# EAGLE design solar_collector_controller_V1.21 (EAGLE 6.5.0)
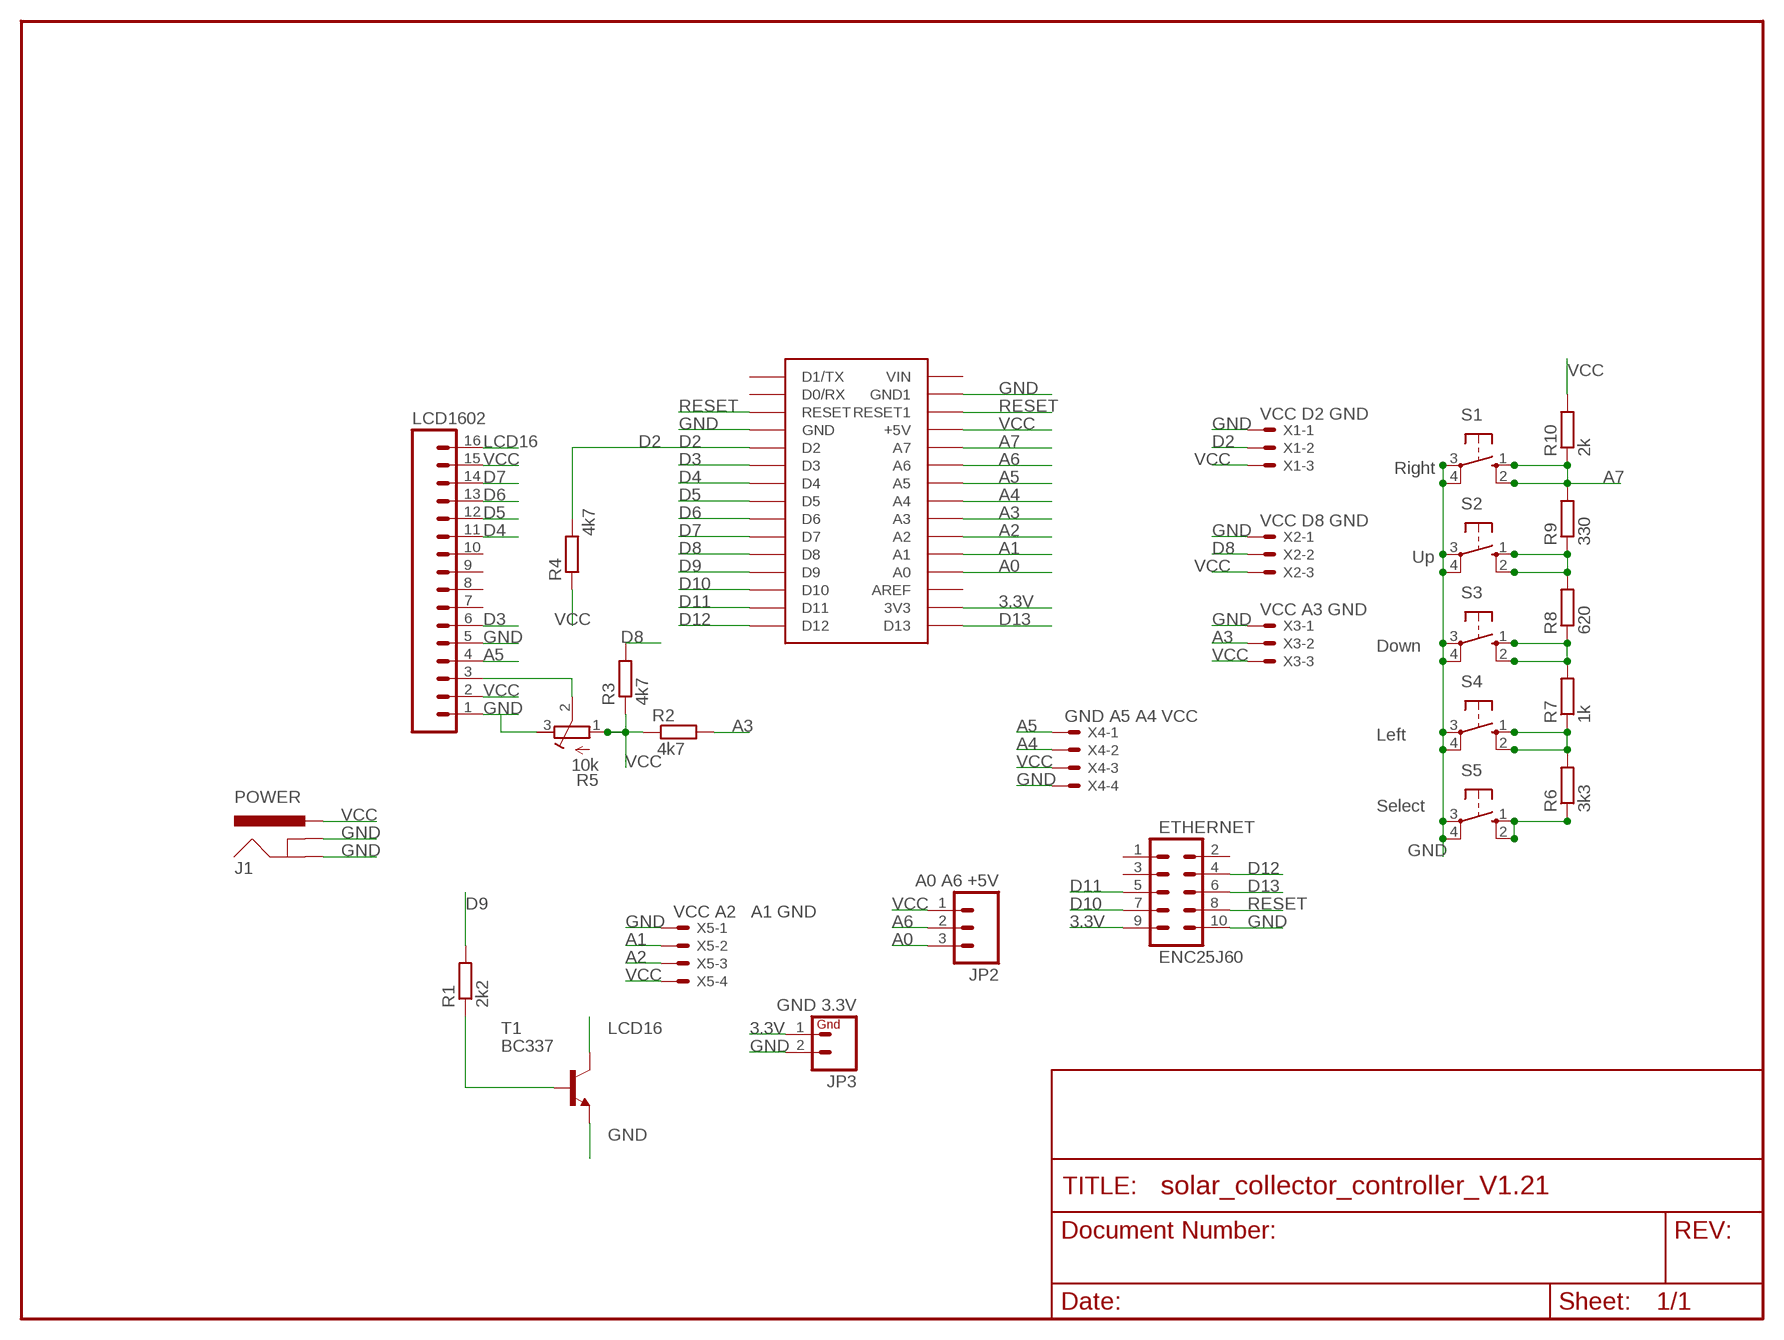
[diagram p0: schematic, sheet 1]

## Parts
ETHERNET  ENC25J60  M05X2PTH  [AVR_ICSP]
J1  POWER  POWER_JACKPTH_LOCK  [POWER_JACK_PTH_LOCK]
JP2  A0 A6 +5V  M03PTH  [1X03]
JP3  GND 3.3V  M02PTH  [1X02]
LCD1602  HEADER-16P-2.54  [16P-2.54]
R1  2k2  R-EU_0207/10  [0207/10]
R2  4k7  R-EU_0207/10  [0207/10]
R3  4k7  R-EU_0207/10  [0207/10]
R4  4k7  R-EU_0207/10  [0207/10]
R5  10k  R-TRIMM64W  [RTRIM64W]
R6  3k3  R-EU_0207/10  [0207/10]
R7  1k  R-EU_0207/10  [0207/10]
R8  620  R-EU_0207/10  [0207/10]
R9  330  R-EU_0207/10  [0207/10]
R10  2k  R-EU_0207/10  [0207/10]
S1  Right  10-XX  [B3F-10XX]
S2  Up  10-XX  [B3F-10XX]
S3  Down  10-XX  [B3F-10XX]
S4  Left  10-XX  [B3F-10XX]
S5  Select  10-XX  [B3F-10XX]
T1  BC337  [TO92]
U$2  ARDUINONANO  [PDIP-32]
X1  VCC D2 GND  22-23-2031  [22-23-2031]
X2  VCC D8 GND  22-23-2031  [22-23-2031]
X3  VCC A3 GND  22-23-2031  [22-23-2031]
X4  GND A5 A4 VCC  22-23-2041  [22-23-2041]
X5  VCC A2 A1 GND  22-23-2041  [22-23-2041]

## Nets
3.3V: ETHERNET.9 JP3.1 U$2.3V3
A0: JP2.3 U$2.A0
A1: U$2.A1 X5.2
A2: U$2.A2 X5.3
A3: R2.2 U$2.A3 X3.2
A4: U$2.A4 X4.2
A5: LCD1602.4 U$2.A5 X4.1
A6: JP2.2 U$2.A6
A7: R9.2 R10.1 S1.1(S) S1.2(S1) U$2.A7
D2: R4.2 U$2.D2 X1.2
D3: LCD1602.6 U$2.D3
D4: LCD1602.11 U$2.D4
D5: LCD1602.12 U$2.D5
D6: LCD1602.13 U$2.D6
D7: LCD1602.14 U$2.D7
D8: R3.2 U$2.D8 X2.2
D9: R1.2 U$2.D9
D10: ETHERNET.7 U$2.D10
D11: ETHERNET.5 U$2.D11
D12: ETHERNET.4 U$2.D12
D13: ETHERNET.6 U$2.D13
GND [vcc]: ETHERNET.10 J1.GND J1.GNDBREAK JP3.2 LCD1602.1 LCD1602.5 R5.3(A) S1.3(P) S1.4(P1) S2.3(P) S2.4(P1) S3.3(P) S3.4(P1) S4.3(P) S4.4(P1) S5.3(P) S5.4(P1) T1.1(E) U$2.GND U$2.GND1 X1.1 X2.1 X3.1 X4.4 X5.1
LCD16: LCD1602.16 T1.3(C)
N$1: LCD1602.3 R5.2(S)
N$4: R1.1 T1.2(B)
N$5: R6.1 S5.1(S) S5.2(S1)
N$6: R6.2 R7.1 S4.1(S) S4.2(S1)
N$8: R7.2 R8.1 S3.1(S) S3.2(S1)
N$11: R8.2 R9.1 S2.1(S) S2.2(S1)
RESET: ETHERNET.8 U$2.RESET U$2.RESET1
VCC: J1.PWR JP2.1 LCD1602.2 LCD1602.15 R2.1 R3.1 R4.1 R5.1(E) R10.2 U$2.+5V X1.3 X2.3 X3.3 X4.3 X5.4
Unconnected: ETHERNET.1 ETHERNET.2 ETHERNET.3 LCD1602.7 LCD1602.8 LCD1602.9 LCD1602.10 U$2.AREF U$2.D0/RX U$2.D1/TX U$2.VIN

## Library data of the parts
ETHERNET = SparkFun-Connectors:M05X2: Header 5x2 Standard 10-pin dual row 0.1" header. Commonly used with AVR-ISP. Use with Spark Fun Electronics SKU: PRT-00778
J1 = SparkFun-Connectors:POWER_JACK: Power Jack This is the standard 5.5mm barrel jack for power. The PTH is the most common, proven, reliable, footprint. The Slot footprint only works if the mill layer is transmitted to the PCB fab house so be warned. Spark Fun Electronics SKU : PRT-00119 SMT: CONN-08106 Mating wall wart : TOL-00298 (and others)
JP2 = SparkFun-Connectors:M03: Header 3 Standard 3-pin 0.1" header. Use with straight break away headers (SKU : PRT-00116), right angle break away headers (PRT-00553), swiss pins (PRT-00743), machine pins (PRT-00117), and female headers (PRT-00115). Molex polarized connector foot print use with SKU : PRT-08232 with associated crimp pins and housings.
JP3 = SparkFun:M02: Header 2 Standard 2-pin 0.1" header. Use with straight break away headers (SKU : PRT-00116), right angle break away headers (PRT-00553), swiss pins (PRT-00743), machine pins (PRT-00117), and female headers (PRT-00115). Molex polarized connector foot print use with SKU : PRT-08233 with associated crimp pins and housings.
LCD1602 = Connector_seedstudio:HEADER-16P
R1-R4 R6-R10 = resistor:R-EU_: RESISTOR, European symbol
R5 = resistor:R-TRIMM: Trimm resistor
S1-S5 = switch-omron:10-XX: OMRON SWITCH; MPN: B3F-1000; OC_FARNELL: 176432; OC_NEWARK: 36M3542
T1 = transistor:BC337: NPN TRANSISTOR
U$2 = rocketfarm:ARDUINONANO
X1-X3 = con-molex:22-23-2031: .100" (2.54mm) Center Header - 3 Pin; MF: MOLEX; MPN: 22-23-2031; OC_FARNELL: 1462950; OC_NEWARK: 30C0862
X4 X5 = con-molex:22-23-2041: .100" (2.54mm) Center Header - 4 Pin; MF: MOLEX; MPN: 22-23-2041; OC_FARNELL: 1462920; OC_NEWARK: 38C0355

## Net classes
0 default: width 0.203 mm
1 vcc: width 0.254 mm

## Board
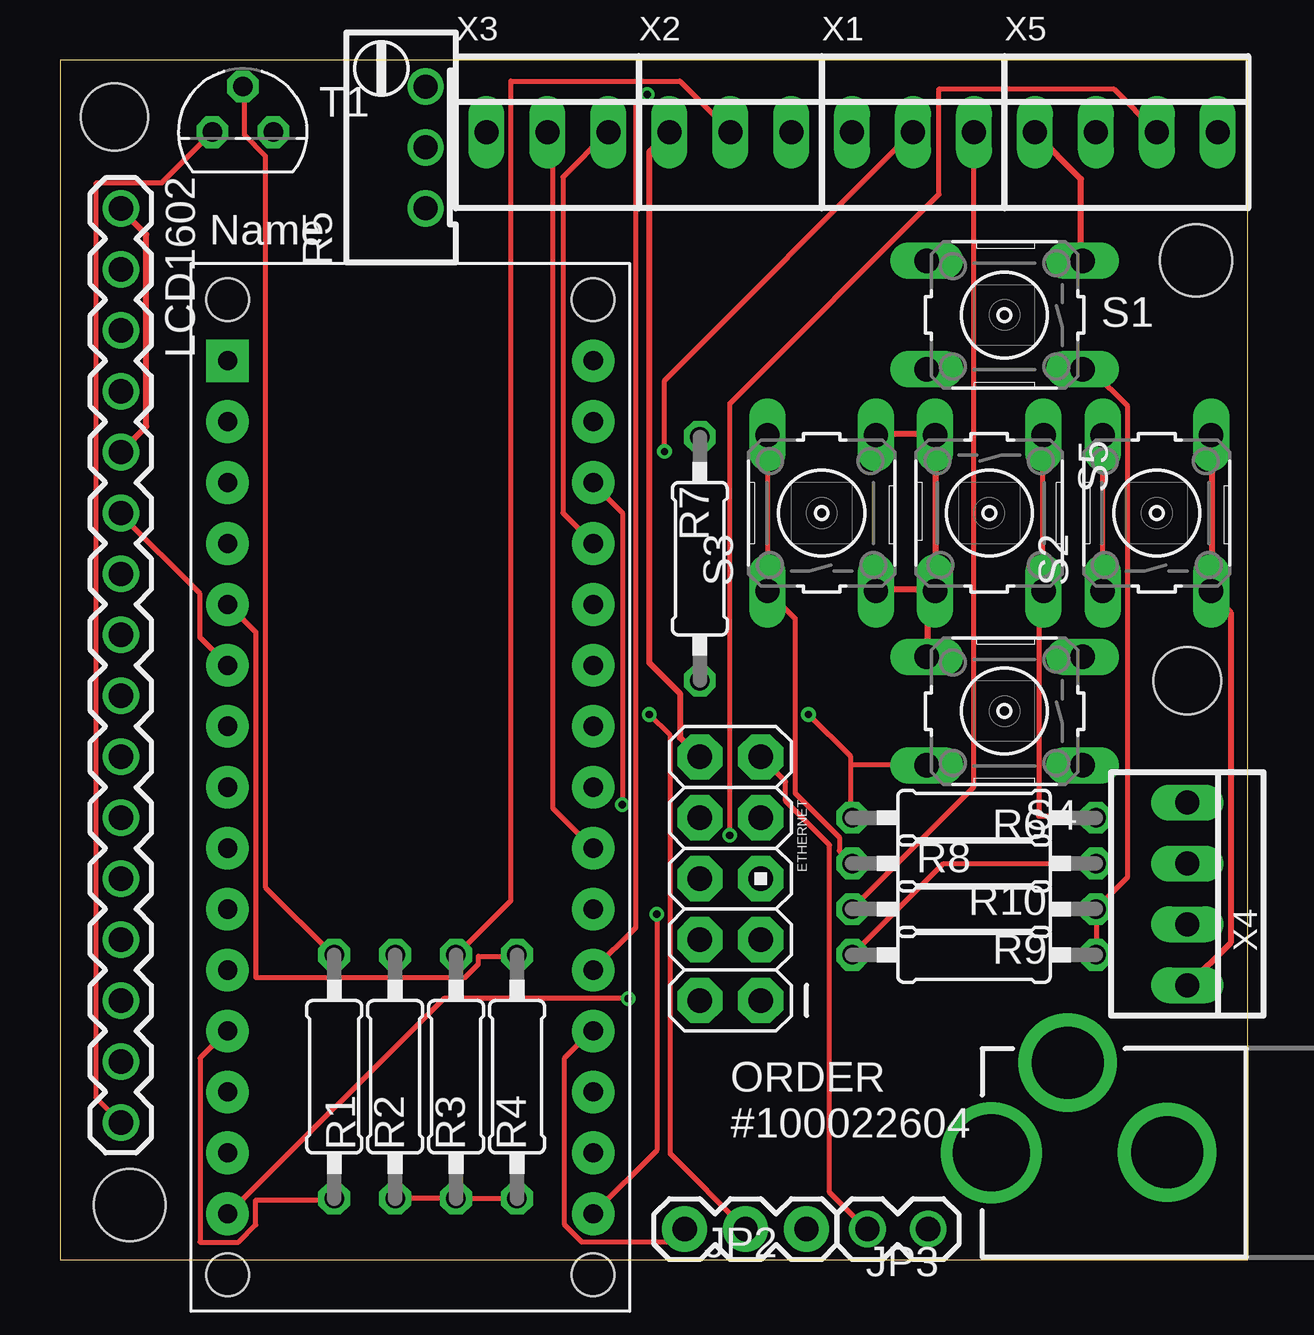
[diagram p1: board, top side]
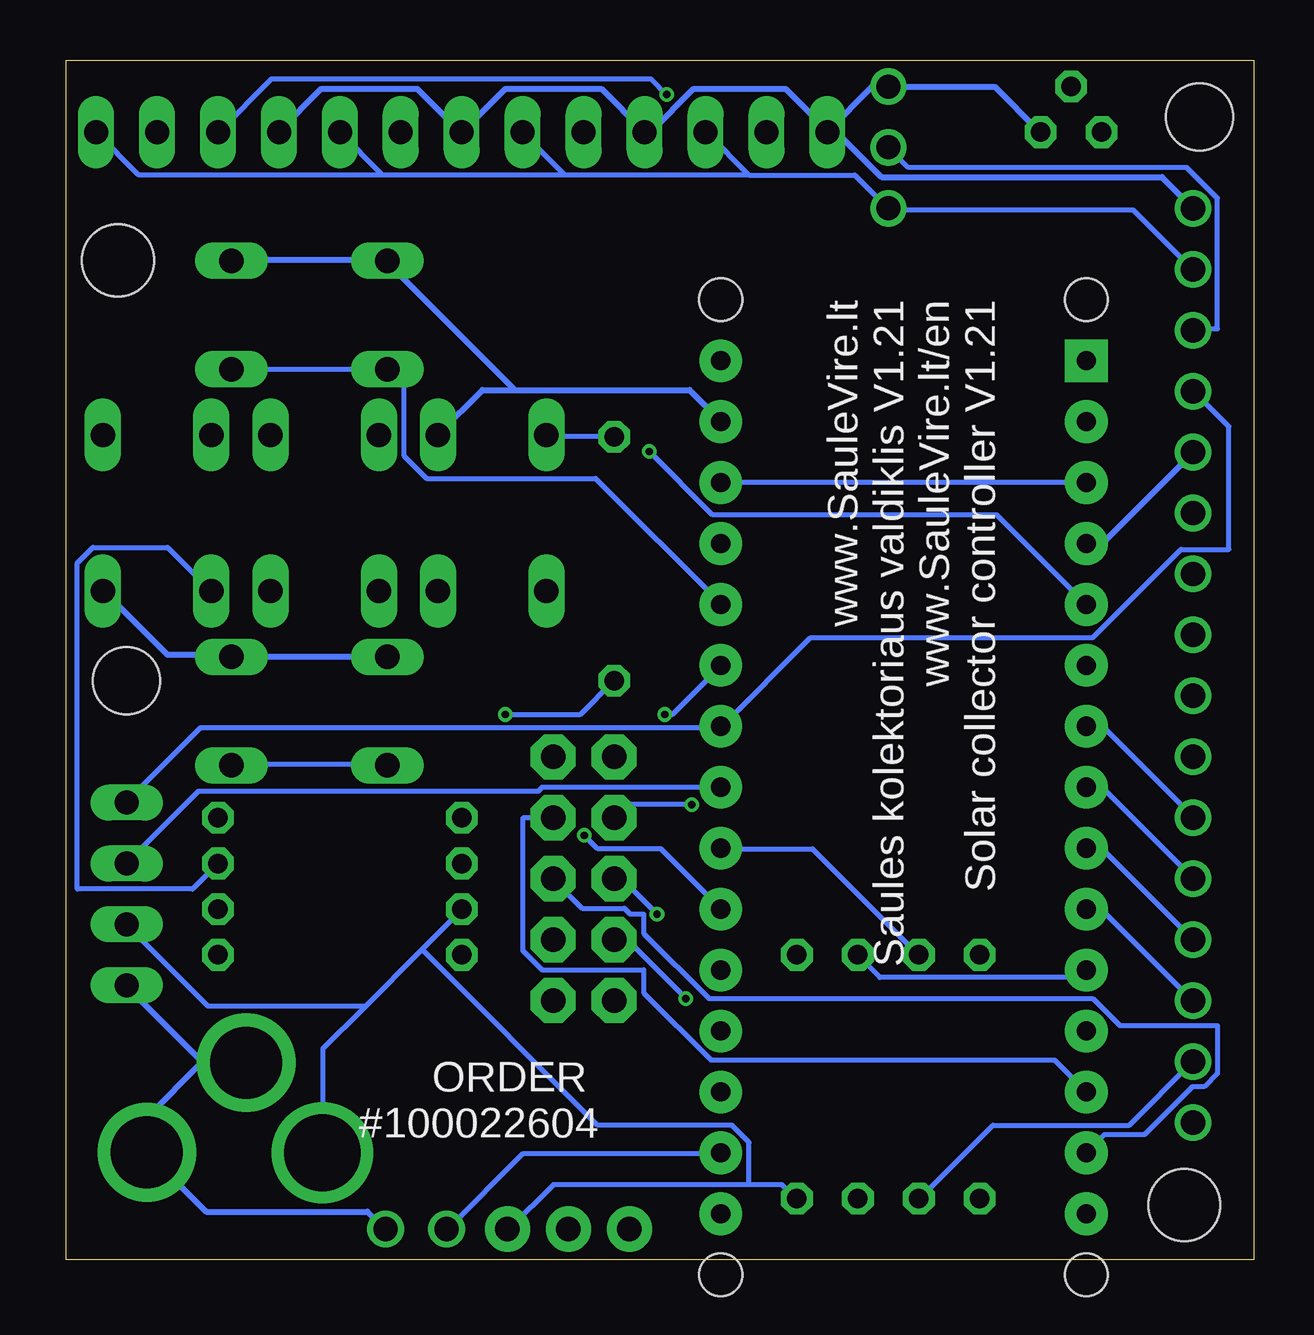
[diagram p2: board, bottom side, seen from below]

Size 49.51 x 50 mm. Coordinates in mm from the lower left corner, seen from the top.
Outline: 0,0 49.51,0 49.51,50 0,50 0,0
Copper layers (1*16): Top 0.035mm / dielectric 1.5mm / Bottom 0.035mm
Design rules "ITEADstudio_DRC": minimum track width 6mil, minimum drill 12mil, track to track 6mil, track to pad 6mil, pad to pad 6mil, via to via 6mil, smd to smd 0mil, copper to edge 10mil, drill to drill 10mil, minimum pad ring 10mil, minimum via ring 6mil, stop-mask expansion 2mil, vias tented up to drill 100mil, thermal gap 10mil
Holes 3 mm at 2.9,2.27 47.35,41.64
Holes 2.8 mm at 2.27,47.62 46.99,24.13

### Footprints (pad centres in the part's own frame; a part is rotated, then mirrored left to right if it is on the bottom)
AVR_ICSP = drill 1.016 pad 1.88 octagon: 1 -1.27,5.08; 2 1.27,5.08; 3 -1.27,2.54; 4 1.27,2.54; 5 -1.27,0; 6 1.27,0; 7 -1.27,-2.54; 8 1.27,-2.54; 9 -1.27,-5.08; 10 1.27,-5.08
POWER_JACK_PTH_LOCK = drill 2.997 pad 4.115: GND 0.025,6.557; GNDBREAK 3.762,10.7 | drill 3.2 pad 4.115: PWR 0,13.878
1X03 = drill 1.016 pad 1.88: 1 0,0; 2 2.54,0; 3 5.08,0
1X02 = drill 1.016: 1 0,0; 2 2.54,0
16P-2.54 = drill 1.016: 1 0,0; 2 2.54,0; 3 5.08,0; 4 7.62,0; 5 10.16,0; 6 12.7,0; 7 15.24,0; 8 17.78,0; 9 20.32,0; 10 22.86,0; 11 25.4,0; 12 27.94,0; 13 30.48,0; 14 33.02,0; 15 35.56,0; 16 38.1,0
0207/10 = drill 0.813 octagon: 1 -5.08,0; 2 5.08,0
RTRIM64W = drill 1: 1 1.27,-2.54; 2 1.27,0; 3 1.27,2.54
B3F-10XX = drill 1.016 long: 1 -3.251,2.261; 2 3.251,2.261; 3 -3.251,-2.261; 4 3.251,-2.261
TO92 = drill 0.813 octagon: 1 1.27,0; 2 0,1.905; 3 -1.27,0
PDIP-32 = drill 0.8 pad 1.778: 3V3 15.24,-35.56; +5V 15.24,-10.16; A0 15.24,-30.48; A1 15.24,-27.94; A2 15.24,-25.4; A3 15.24,-22.86; A4 15.24,-20.32; A5 15.24,-17.78; A6 15.24,-15.24; A7 15.24,-12.7; AREF 15.24,-33.02; D0/RX 0,-5.08; D2 0,-12.7; D3 0,-15.24; D4 0,-17.78; D5 0,-20.32; D6 0,-22.86; D7 0,-25.4; D8 0,-27.94; D9 0,-30.48; D10 0,-33.02; D11 0,-35.56; D12 0,-38.1; D13 15.24,-38.1; GND 0,-10.16; GND1 15.24,-5.08; RESET 0,-7.62; RESET1 15.24,-7.62; VIN 15.24,-2.54 | drill 0.8 pad 1.778 square: D1/TX 0,-2.54 | hole 1.778: 0,0; 0,-40.64; 15.24,-40.64; 15.24,0
22-23-2031 = drill 1 long: 1 -2.54,0; 2 0,0; 3 2.54,0
22-23-2041 = drill 1 long: 1 -3.81,0; 2 -1.27,0; 3 1.27,0; 4 3.81,0

### Placement (x,y rotation side)
ETHERNET  27.94,15.88 180 top
J1  52.7,4.45 90 top
JP2  31.11,1.27 180 top
JP3  33.66,1.27 0 top
LCD1602  2.54,43.81 270 top
R1  11.43,7.62 270 top
R2  13.97,7.62 90 top
R3  16.51,7.62 90 top
R4  19.05,7.62 90 top
R5  13.97,46.35 0 top
R6  38.1,18.41 180 top
R7  26.67,29.21 90 top
R8  38.1,16.51 0 top
R9  38.1,12.7 0 top
R10  38.1,14.61 180 top
S1  39.37,39.37 180 top
S2  45.72,31.11 90 top
S3  31.75,31.11 90 top
S4  39.37,22.86 180 top
S5  38.73,31.11 270 top
T1  7.62,46.99 0 top
U$2  6.99,40.01 0 top
X1  35.56,46.99 0 top
X2  27.94,46.99 0 top
X3  20.32,46.99 0 top
X4  46.99,15.24 270 top
X5  44.45,46.99 0 top

### Tracks (layer width: path | path; a pad name or v marks a point on that pad's centre or on a via)
3.3V
  Top 0.203: ETHERNET.9 29.28,20.88 30.24,19.92 30.24,19.12 32.08,17.28 32.08,2.8 33.6,1.28 JP3.1
  Bottom 0.203: JP3.1 33.6,1.28 30.48,4.4 22.24,4.4 U$2.3V3
A0
  Top 0.203: U$2.A0 22.16,9.52 21.04,8.4 21.04,1.44 21.76,0.72 26,0.72 26,1.2 JP2.3
A1  (via drill 0.3)
  Top 0.203: v24.48,48.56 24,48.08 24,13.84 U$2.A1
  Bottom 0.203: v24.48,48.56 25.12,49.2 40.96,49.2 43.12,47.04 X5.2
A2  (via drill 0.3)
  Top 0.203: v27.92,17.68 27.92,35.68 36.64,44.4 36.64,48.8 43.92,48.8 45.68,47.04 X5.3
  Bottom 0.203: v27.92,17.68 27.36,17.12 24.72,17.12 22.24,14.64 U$2.A2
A3
  Top 0.203: X3.2 20.32,46.96 20.56,46.72 20.56,18.8 22.16,17.2 U$2.A3
  Bottom 0.203: R2.2 14,12.72 18.4,17.12 22.16,17.12 U$2.A3
A4
  Bottom 0.203: X4.2 46.96,16.56 44,19.52 29.84,19.52 29.68,19.68 U$2.A4
A5
  Bottom 0.203: X4.1 46.96,19.12 43.92,22.16 22.24,22.16 U$2.A5 22.16,22.24 18.48,25.92 6.72,25.92 3.04,29.6 1.04,29.6 1.04,34.72 2.48,36.16 LCD1602.4
A6  (via drill 0.3)
  Top 0.203: v24.56,22.72 25.44,21.84 25.44,4.4 JP2.2
  Bottom 0.203: v24.56,22.72 24.24,22.72 22.24,24.72 U$2.A6
A7
  Top 0.203: R9.2 43.2,12.72 43.2,14.56 R10.1 43.2,14.64 44.48,15.92 44.48,35.6 43.04,37.04 42.64,37.04 S1.1
  Bottom 0.203: S1.1 42.56,37.12 36.16,37.12 S1.2 36.08,37.04 35.44,37.04 35.44,33.52 34.48,32.56 27.44,32.56 22.24,27.36 U$2.A7
D2  (via drill 0.3)
  Top 0.203: R4.2 19.04,12.64 17.44,12.64 17.44,12.32 16.88,11.76 8.16,11.76 8.16,26.16 7.04,27.28 U$2.D2 | v25.2,33.68 25.2,36.64 35.52,46.96 X1.2
  Bottom 0.203: v25.2,33.68 22.56,31.04 10.72,31.04 U$2.D2
D3
  Top 0.203: LCD1602.6 2.56,31.04 5.84,27.76 5.84,25.92 6.96,24.8 U$2.D3
D4
  Bottom 0.203: LCD1602.11 2.56,18.48 6.24,22.16 6.96,22.16 U$2.D4
D5
  Bottom 0.203: LCD1602.12 2.56,15.92 6.32,19.68 6.96,19.68 U$2.D5
D6
  Bottom 0.203: LCD1602.13 2.56,13.36 6.32,17.12 6.96,17.12 U$2.D6
D7
  Bottom 0.203: LCD1602.14 2.56,10.8 6.32,14.56 6.96,14.56 U$2.D7
D8
  Top 0.203: X2.2 27.92,47.04 25.84,49.12 18.8,49.12 18.8,14.96 16.56,12.72 R3.2
  Bottom 0.203: R3.2 16.48,12.64 15.6,11.76 7.28,11.76 7.04,12 U$2.D8
D9
  Top 0.203: R1.2 11.36,2.48 8.16,2.48 8.16,1.44 7.44,0.72 5.84,0.72 5.84,8.4 6.96,9.52 U$2.D9
D10
  Bottom 0.203: U$2.D10 8.32,8.32 22.64,8.32 25.44,11.12 25.44,12.08 29.68,12.08 30.48,12.88 30.48,18.4 29.28,18.4 ETHERNET.7
D11
  Bottom 0.203: U$2.D11 6.96,4.48 6.24,5.2 4.56,5.2 2.56,7.2 2.08,7.2 1.52,7.76 1.52,9.76 5.6,9.76 6.72,10.88 22.72,10.88 25.44,13.6 25.44,14.4 26,14.4 26.24,14.64 28,14.64 29.2,15.84 ETHERNET.5
D12  (via drill 0.3)
  Top 0.203: v23.68,10.88 16,10.88 7.04,1.92 U$2.D12
  Bottom 0.203: v23.68,10.88 26.08,13.28 26.64,13.28 ETHERNET.4
D13  (via drill 0.3)
  Top 0.203: U$2.D13 24.88,4.56 v24.88,14.4
  Bottom 0.203: v24.88,14.4 26.32,15.84 26.64,15.84 ETHERNET.6
GND
  Top 0.254: LCD1602.1 2.56,43.76 3.6,42.72 3.6,34.72 2.56,33.68 LCD1602.5 | ETHERNET.10 26.64,20.96 25.84,21.76 25.84,23.6 24.56,24.88 24.56,46.16 25.36,46.96 X2.1 | S2.4 48,34.32 48,27.92 S2.3 48,27.76 48.8,26.96 48.8,13.2 47.04,11.44 X4.4 | S3.3 34.08,27.92 36.4,27.92 S5.4 | S4.4 36.16,25.2 36.16,27.84 S5.4 | X5.1 40.64,46.96 42.56,45.04 42.56,41.68 S1.3 | S3.4 34.08,34.4 36.4,34.4 S5.3 36.48,34.24 36.48,28 S5.4
  Bottom 0.254: LCD1602.5 2.56,33.6 6.24,29.92 6.96,29.92 U$2.GND | T1.1 8.96,47.04 10.8,48.88 15.2,48.88 R5.3 15.36,48.88 15.92,48.88 17.76,47.04 X3.1 | X3.1 17.84,47.12 19.52,48.8 23.36,48.8 25.12,47.04 25.28,47.04 X2.1 25.44,47.04 27.2,48.8 31.2,48.8 32.96,47.04 X1.1 33.12,47.04 34.88,48.8 38.88,48.8 40.64,47.04 X5.1 | LCD1602.1 2.56,43.84 3.84,45.12 15.52,45.12 17.52,47.12 X3.1 | X4.4 46.96,11.36 43.84,8.24 42.08,8.24 J1.GNDBREAK 43.92,8.16 46.08,6 46.08,4.56 J1.GND 46.08,4.4 43.68,2 36.96,2 36.24,1.28 JP3.2 | S4.4 36.16,25.12 42.56,25.12 S4.3 42.72,25.2 45.28,25.2 47.92,27.84 S2.3 | S1.3 42.56,41.68 36.16,41.68 S1.4 36.08,41.52 30.88,36.32 30.88,36.24 | 30.88,36.24 32.16,36.24 34,34.4 S3.4 | 30.88,36.24 23.52,36.24 22.24,34.96 U$2.GND1
LCD16
  Top 0.203: T1.3 4.24,44.88 1.52,44.88 1.52,6.72 2.48,5.76 LCD1602.16
N$1
  Bottom 0.203: R5.2 15.2,46.32 14.4,45.52 2.8,45.52 1.52,44.24 1.52,38.8 2.48,38.8 LCD1602.3
N$4
  Top 0.203: R1.1 11.36,12.72 8.56,15.52 8.56,46 7.68,46.88 7.68,48.88 T1.2
N$5
  Top 0.203: R6.1 43.12,18.48 40.8,18.48 40.8,27.68 40.96,27.84 S5.2 40.96,27.92 40.96,34.32 S5.1
N$6  (via drill 0.3)
  Top 0.203: v31.2,22.72 32.96,20.96 32.96,20.64 | 32.96,20.64 32.96,18.48 R6.2 | 32.96,20.64 36.08,20.64 S4.2
  Bottom 0.203: R7.1 28.08,22.72 v31.2,22.72 | S4.1 42.56,20.64 36.16,20.64 S4.2
N$8
  Top 0.203: R8.1 32.96,16.56 32.48,17.04 32.48,17.6 30.64,19.44 30.64,26.72 29.52,27.84 S3.1 29.52,27.92 29.52,34.32 S3.2
  Bottom 0.203: R7.2 26.72,34.32 29.44,34.32 S3.2
N$11
  Top 0.203: S2.1 43.44,27.92 43.44,34.32 S2.2 | R9.1 36.8,16.48 43.12,16.48 R8.2
  Bottom 0.203: S2.1 43.52,27.92 45.28,29.68 48.4,29.68 49.04,29.04 49.04,15.44 44.24,15.44 43.2,16.48 R8.2
RESET  (via drill 0.3)
  Top 0.203: v23.44,18.96 23.44,31.12 22.24,32.32 U$2.RESET1
  Bottom 0.203: U$2.RESET 7.04,32.4 22.16,32.4 U$2.RESET1 | v23.44,18.96 26.16,18.96 26.64,18.48 ETHERNET.8
VCC
  Top 0.203: R2.1 14,2.56 16.48,2.56 R3.1 16.56,2.56 19.04,2.56 R4.1 | U$2.+5V 22.16,29.92 20.96,31.12 20.96,45.12 22.8,46.96 X3.3 | R10.2 33.04,14.64 38.08,19.68 38.08,46.96 X1.3
  Bottom 0.203: 37.08,10.52 38.8,8.8 38.8,4.48 J1.PWR | 37.08,10.52 34.68,12.92 | 34.68,12.92 33.04,14.56 R10.2 | X4.3 46.96,13.92 43.6,10.56 37.12,10.56 37.08,10.52 | LCD1602.15 2.56,8.24 5.2,5.6 10.88,5.6 13.92,2.56 R2.1 | 21.04,3.12 19.68,3.12 19.12,2.56 R4.1 | 21.04,3.12 29.2,3.12 31.04,1.28 JP2.1 | 34.68,12.92 27.36,5.6 21.76,5.6 21.04,4.88 21.04,3.12 | 21.04,45.2 16.64,45.2 15.28,43.84 R5.1 15.2,43.76 5.04,43.76 2.56,41.28 LCD1602.2 | 21.04,45.2 22.8,46.96 X3.3 | 28.76,45.24 28.72,45.2 21.04,45.2 | 28.76,45.24 30.48,46.96 X2.3 | 36.36,45.24 36.32,45.2 28.8,45.2 28.76,45.24 | 36.36,45.24 38.08,46.96 X1.3 | X5.4 48.24,46.96 46.48,45.2 36.4,45.2 36.36,45.24

### Text on the board
tPlace: ORDER / #100022604
bPlace: www.SauleVire.lt / Saules kolektoriaus valdiklis V1.21 / www.SauleVire.lt/en / Solar collector controller V1.21 | ORDER / #100022604